# EAGLE design controller (EAGLE 9.6.2)
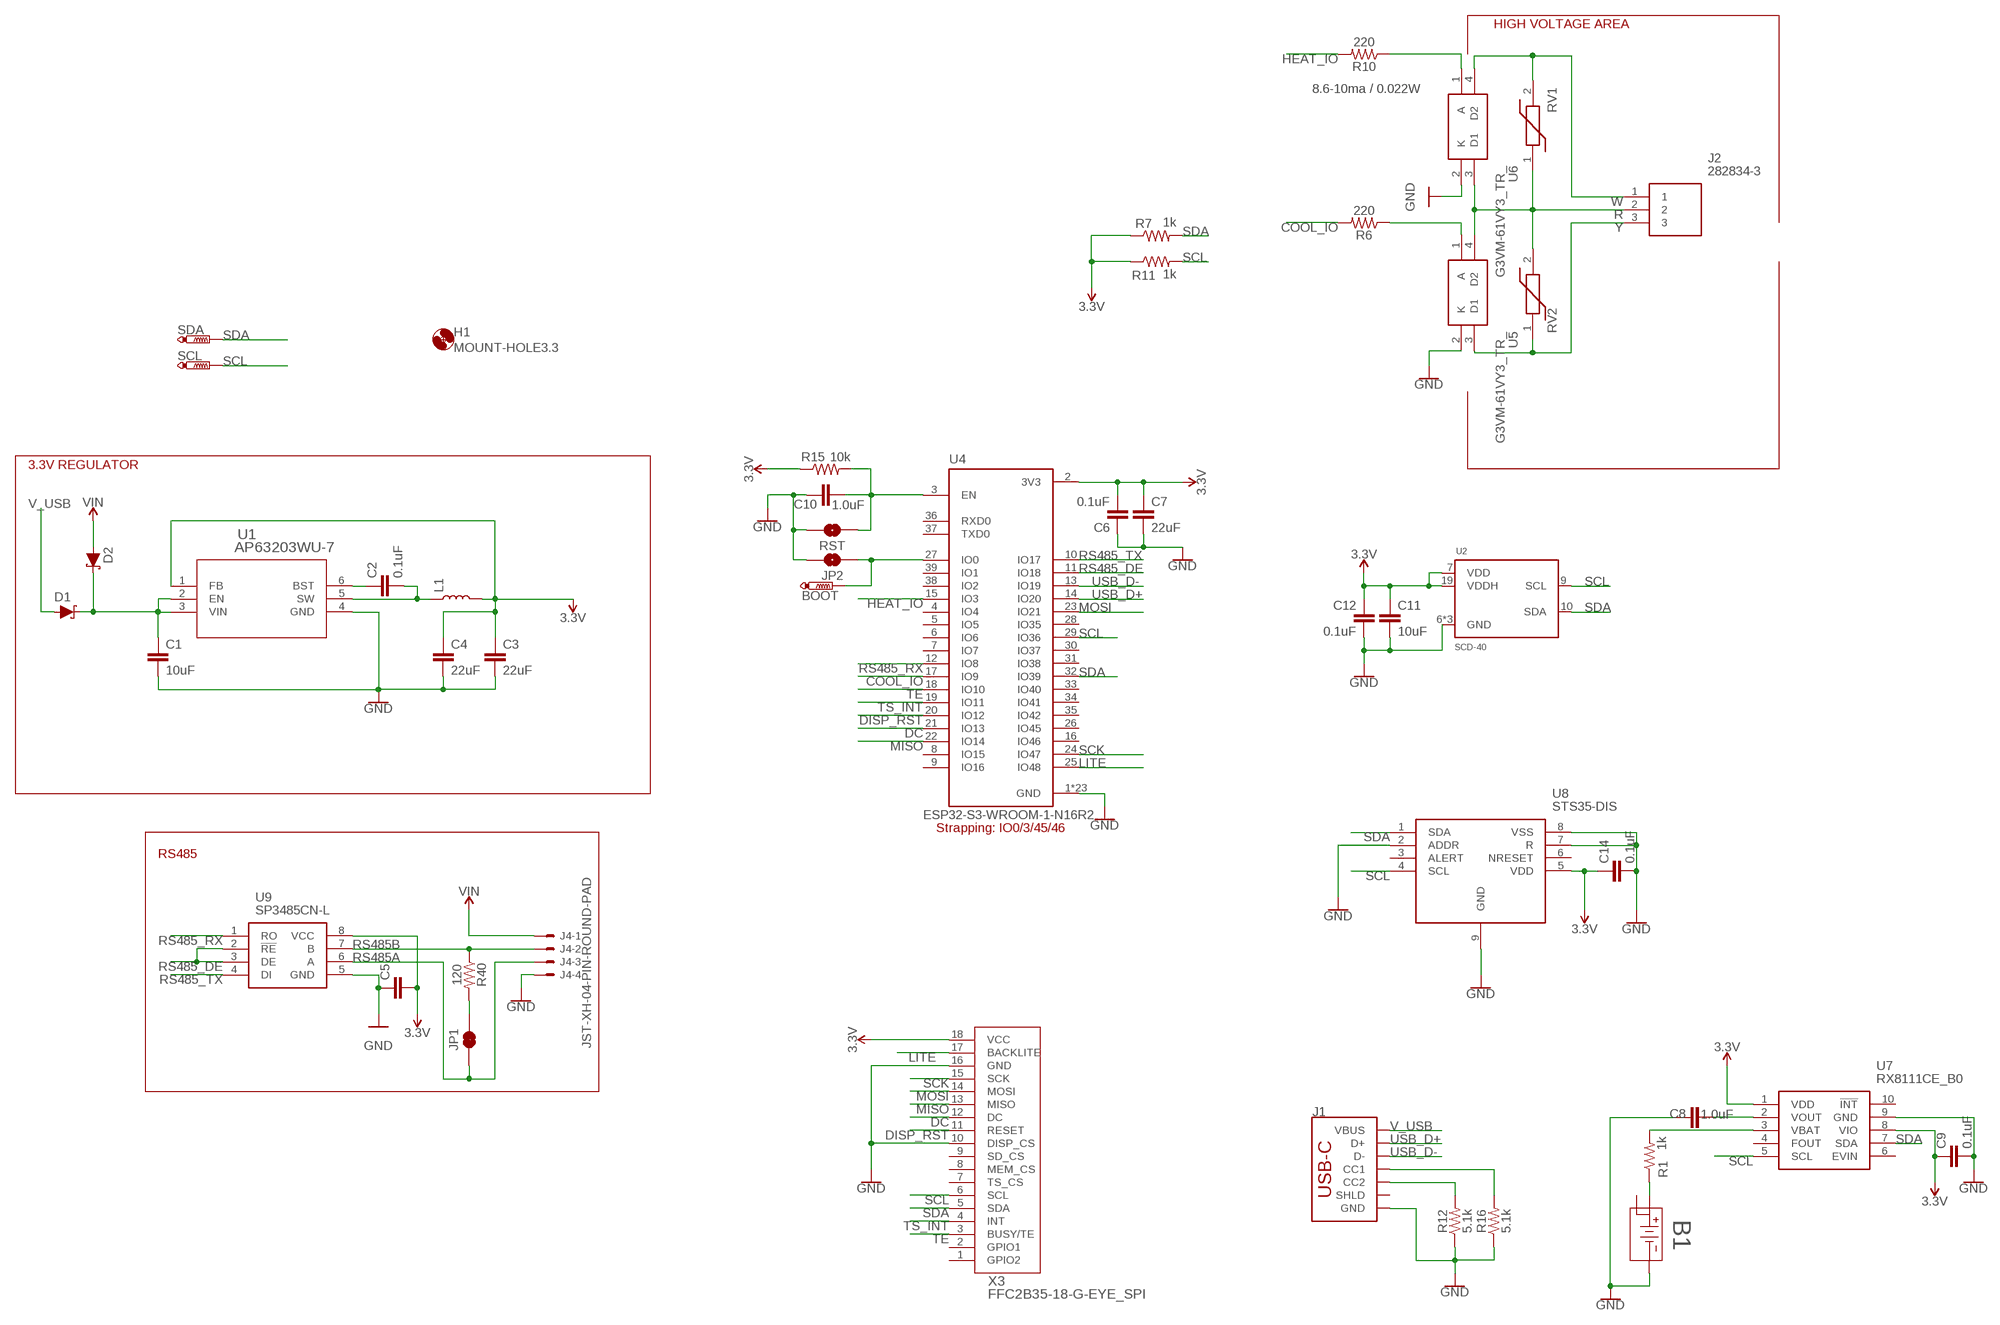
[diagram p0: schematic, sheet 1]

## Parts
B1  BAT-HLD-012-SMT  [BAT-HLD-012-SMT_TEC]
BOOT  PTR1B1,27  [B1,27]
C1  10uF  10UF-1206-6.3V-20%  [1206]
C2  0.1uF  0.1UF-0603-25V-5%  [0603]
C3  22uF  22UF-0805-6.3V-20%  [0805]
C4  22uF  22UF-0805-6.3V-20%  [0805]
C5  0.1uF  0.1UF-0603-25V-5%  [0603]
C6  0.1uF  0.1UF-0603-25V-5%  [0603]
C7  22uF  22UF-0805-6.3V-20%  [0805]
C8  1.0uF  1.0UF-0603-16V-10%  [0603]
C9  0.1uF  0.1UF-0603-25V-5%  [0603]
C10  1.0uF  1.0UF-0603-16V-10%  [0603]
C11  10uF  10UF-1206-6.3V-20%  [1206]
C12  0.1uF  0.1UF-0603-25V-5%  [0603]
C14  0.1uF  0.1UF-0603-25V-5%  [0603]
D1  1A/23V/620mV  DIODE-SCHOTTKY-BAT20J  [SOD-323]
D2  1A/23V/620mV  DIODE-SCHOTTKY-BAT20J  [SOD-323]
H1  MOUNT-HOLE3.3  [3,3]
J1  USB_C_2-LAYER_PADS  [USB-C-16P-2LAYER-PADS]
J2  282834-3  [2828343]
J4  JST-XH-04-PIN-ROUND-PAD  [JST-XH-04-PACKAGE-ROUND-PAD]
JP1  JUMPER-SMT_2_NC_TRACE_NO-SILK  [SMT-JUMPER_2_NC_TRACE_NO-SILK]
JP2  JUMPER-SMT_2_NO_NO-SILK  [SMT-JUMPER_2_NO_NO-SILK]
L1  4.7μH_SHIELDED_INDUCTOR  [1008(2520)]
R1  1k  1KOHM-0603-1/10W-1%  [0603]
R6  220  220OHM-0603-1/10W-1%  [0603]
R7  1k  1KOHM-0603-1/10W-1%  [0603]
R10  220  220OHM-0603-1/10W-1%  [0603]
R11  1k  1KOHM-0603-1/10W-1%  [0603]
R12  5.1k  5.1KOHM5.1KOHM-0603-1/10W-1%  [0603]
R15  10k  10KOHM-0603-1/10W-1%  [0603]
R16  5.1k  5.1KOHM5.1KOHM-0603-1/10W-1%  [0603]
R40  120  120OHM-0603-1/10W-5%  [0603]
RST  JUMPER-SMT_2_NO_NO-SILK  [SMT-JUMPER_2_NO_NO-SILK]
RV1  ZV35K1210251NIR1  [VARC3225X145N]
RV2  ZV35K1210251NIR1  [VARC3225X145N]
SCL  PTR1B1,27  [B1,27]
SDA  PTR1B1,27  [B1,27]
U1  AP63203WU-7  [SOIC_05WU-7_DIO]
U2  SCD-40  [SCD40]
U4  ESP32-S3-WROOM-1-N16R2  [XCVR_ESP32-S3-WROOM-1-N16R2]
U5  G3VM-61VY3_TR_  [G3VM61VY3TR]
U6  G3VM-61VY3_TR_  [G3VM61VY3TR]
U7  RX8111CE_B0  [RX8111CEB0]
U8  STS35-DIS  [SON50P250X250X100-9N]
U9  SP3485CN-L  [SOIC127P600X175-8N]
X3  FFC2B35-18-G-EYE_SPI  [FFC2B3518G]

## Nets
3.3V: C3.1 C4.1 C5.2 C6.2 C7.1 C9.1 C11.1 C12.2 C14.1 L1.2 R7.1 R11.1 R15.1 U1.1(FB) U2.7(VDD) U2.19(VDDH) U4.2(3V3) U7.1(VDD) U7.8(VIO) U8.5(VDD) U9.8(VCC) X3.18(VCC)
COOL_IO: R6.2 U4.17(IO9)
DC: U4.21(IO13) X3.12(DC)
DISP_RST: U4.20(IO12) X3.11(RESET)
GND: B1.3 C1.2 C3.2 C4.2 C5.1 C6.1 C7.2 C8.1 C9.2 C10.1 C11.2 C12.1 C14.2 J1.GND J1.GND2(GND) J4.4 JP2.2 R12.1 R16.1 RST.2 U1.4(GND) U2.6(GND) U2.20(GND) U2.P$1(GND) U4.1(GND) U4.40(GND) U4.41_1(GND) U4.41_2(GND) U4.41_3(GND) U4.41_4(GND) U4.41_5(GND) U4.41_6(GND) U4.41_7(GND) U4.41_8(GND) U4.41_9(GND) U4.41_10(GND) U4.41_11(GND) U4.41_12(GND) U4.41_13(GND) U4.41_14(GND) U4.41_15(GND) U4.41_16(GND) U4.41_17(GND) U4.41_18(GND) U4.41_19(GND) U4.41_20(GND) U4.41_21(GND) U5.2(K) U6.2(K) U7.9(GND) U8.2(ADDR) U8.7(R) U8.8(VSS) U8.9(GND) U9.5(GND) X3.10(DISP_CS) X3.16(GND)
HEAT_IO: R10.2 U4.15(IO3)
LITE: U4.25(IO48) X3.17(BACKLITE)
MISO: U4.22(IO14) X3.13(MISO)
MOSI: U4.23(IO21) X3.14(MOSI)
N$1: C2.2 L1.1 U1.5(SW)
N$2: C2.1 U1.6(BST)
N$3: BOOT.TP JP2.1 U4.27(IO0)
N$4: R6.1 U5.1(A)
N$5: JP1.2 R40.2
N$6: B1.1 R1.1
N$7: J1.A5(CC1) R16.2
N$9: C10.2 R15.2 RST.1 U4.3(EN)
N$10: R10.1 U6.1(A)
N$14: J1.B5(CC2) R12.2
R: J2.2 RV1.1 RV2.2 U5.4(D2) U6.3(D1)
REG_IN: C1.1 D1.C D2.C U1.2(EN) U1.3(VIN)
RS485_DE: U4.11(IO18) U9.2(!RE) U9.3(DE)
RS485_RX: U4.12(IO8) U9.1(RO)
RS485_TX: U4.10(IO17) U9.4(DI)
RS485A: J4.3 JP1.1 U9.6(A)
RS485B: J4.2 R40.1 U9.7(B)
RTC_VBAT: R1.2 U7.3(VBAT)
RTC_VOUT: C8.2 U7.2(VOUT)
SCK: U4.24(IO47) X3.15(SCK)
SCL: R11.2 SCL.TP U2.9(SCL) U4.29(IO36) U7.5(SCL) U8.4(SCL) X3.6(SCL)
SDA: R7.2 SDA.TP U2.10(SDA) U4.32(IO39) U7.7(SDA) U8.1(SDA) X3.5(SDA)
TE: U4.18(IO10) X3.3(BUSY/TE)
TS_INT: U4.19(IO11) X3.4(INT)
USB_D+: J1.A6(D+) J1.B6(D+) U4.14(IO20)
USB_D-: J1.A7(D-) J1.B7(D-) U4.13(IO19)
V_USB: D1.A J1.VBUS1(VBUS) J1.VBUS2(VBUS)
VIN: D2.A J4.1
W: J2.1 RV1.2 U6.4(D2)
Y: J2.3 RV2.1 U5.3(D1)
Unconnected: B1.2 J1.SHLD1(SHLD) J1.SHLD2(SHLD) J1.SHLD3(SHLD) J1.SHLD4(SHLD) U4.4(IO4) U4.5(IO5) U4.6(IO6) U4.7(IO7) U4.8(IO15) U4.9(IO16) U4.16(IO46) U4.26(IO45) U4.28(IO35) U4.30(IO37) U4.31(IO38) U4.33(IO40) U4.34(IO41) U4.35(IO42) U4.36(RXD0) U4.37(TXD0) U4.38(IO2) U4.39(IO1) U7.4(FOUT) U7.6(EVIN) U7.10(!INT) U8.3(ALERT) U8.6(NRESET) X3.1(GPIO2) X3.2(GPIO1) X3.7(TS_CS) X3.8(MEM_CS) X3.9(SD_CS)

## Notes on the sheet
- HIGH VOLTAGE AREA
- 8.6-10ma / 0.022W
- 3.3V REGULATOR
- Strapping: IO0/3/45/46
- RS485

## Library data of the parts
B1 = Battery holders:BAT-HLD-012-SMT; COPYRIGHT: Copyright (C) 2024 Ultra Librarian. All rights reserved.; MANUFACTURER_PART_NUMBER: BAT-HLD-012-SMT; MFR_NAME: TE Connectivity
BOOT SCL SDA = testpad:PTR1: TEST PIN
C1 C11 = SparkFun-Capacitors:10UF: 10.0µF ceramic capacitors A capacitor is a passive two-terminal electrical component used to store electrical energy temporarily in an electric field.; PROD_ID: CAP-10057
C2 C5 C6 C9 C12 C14 = SparkFun-Capacitors:0.1UF: 0.1µF ceramic capacitors A capacitor is a passive two-terminal electrical component used to store electrical energy temporarily in an electric field.; PROD_ID: CAP-08604
C3 C4 C7 = SparkFun-Capacitors:22UF: 22µF ceramic capacitors A capacitor is a passive two-terminal electrical component used to store electrical energy temporarily in an electric field.; PROD_ID: CAP-08402
C8 C10 = SparkFun-Capacitors:1.0UF: 1µF ceramic capacitors A capacitor is a passive two-terminal electrical component used to store electrical energy temporarily in an electric field.; PROD_ID: CAP-00868
D1 D2 = SparkFun-DiscreteSemi:DIODE-SCHOTTKY: Schottky diode A Schottky diode is a semiconductor diode which has a low forward voltage drop and a very fast switching action.; PROD_ID: DIO-11623
H1 = holes:MOUNT-HOLE: MOUNTING HOLE with drill center marker
J1 = SparkFun-Connectors:USB_C: USB Type C 16Pin Connector Super Speed pins not available on the 16-pin purely SMD connector so this part is best for USB 2.0 implementations. D1 and D2 are tied together enabling D+/- no matter which way the cable is plugged into the connector. The two channel configuration pins (CC1/2) are exposed. These are normally connected to ground via 5.1k resistors but can be reconfigured for high current/high power applications. **4-LAYER BOARD WARNING!!** If designing 4-layer board, make sure to select the variant _4-LAYER-ISOLATED. The linked footprint (USB-C-16-4LAYER-ISOLATED) includes some very necessary cutout polygons in the inner layers (2 and 15). This prevents the PTH mounting shield legs on the USB connector from electrically connecting any other polygons on the inner layers (usually VCC and GND).; PROD_ID: CONN-14122
J2 = TE terminal block 282834-3:282834-3: Connector pcb 3 way 2.54mm Termi-Block Source: Datasheet <https://www.te.com/commerce/DocumentDelivery/DDEController?Action=showdoc&DocId=Customer Drawing282834C1pdfEnglishENG_CD_282834_C1.pdf282834-3>; DESCRIPTION: Connector pcb 3 way 2.54mm Termi-Block; HEIGHT: 10mm; MANUFACTURER_NAME: TE Connectivity; MANUFACTURER_PART_NUMBER: 282834-3; MOUSER_PART_NUMBER: 571-2828343; MOUSER_PRICE-STOCK: https://www.mouser.co.uk/ProductDetail/TE-Connectivity/282834-3?qs=A%252Bip%252BNCYi6M69kAjqV38yA%3D%3D
J4 = Rembrandt Electronics - JST XH Connectors v1-0:JST-XH-04-PIN: JST XH Connector 2 Pin Wire to board connector. Pitch: 2,54 mm, (0.100") Number of pins: 4 Created by Rembrandt Electronics www.rembrandtelectronics.com
JP1 = SparkFun-Jumpers:JUMPER-SMT_2_NC_TRACE: Normally closed trace jumper This jumper has a trace between two pads so it's normally closed (NC). Use a razor knife to open the connection. For best results follow the IPC guidelines for cutting traces: Cutout at least 0.063 mm (0.005 in). Remove all loose material to clean up the cut area. Seal the cut with an approved epoxy. Reapply solder to reclose the connection.
JP2 RST = SparkFun-Jumpers:JUMPER-SMT_2_NO: Normally open jumper This jumper has two pads in close proximity to each other. Apply solder to close the connection. Round pads are easier to solder for beginners, but are a lot larger. SparkFun Product that uses the round pads: SparkFun EL Sequencer <https://www.sparkfun.com/products/12781>
L1 = SparkFun-Coils:4.7μH_SHIELDED_INDUCTOR: 4.7uH Inductor 4.7uH 1.4A 50mOhm 1008(2520) Package Shielded; PROD_ID: NDUC-14880
R1 R7 R11 = SparkFun-Resistors:1KOHM: 1kΩ resistor A resistor is a passive two-terminal electrical component that implements electrical resistance as a circuit element. Resistors act to reduce current flow, and, at the same time, act to lower voltage levels within circuits. - Wikipedia; PROD_ID: RES-07856
R6 R10 = SparkFun-Resistors:220OHM: 220Ω resistor A resistor is a passive two-terminal electrical component that implements electrical resistance as a circuit element. Resistors act to reduce current flow, and, at the same time, act to lower voltage levels within circuits. - Wikipedia; PROD_ID: RES-07861
R12 R16 = SparkFun-Resistors:5.1KOHM; PROD_ID: RES-12083
R15 = SparkFun-Resistors:10KOHM: 10kΩ resistor A resistor is a passive two-terminal electrical component that implements electrical resistance as a circuit element. Resistors act to reduce current flow, and, at the same time, act to lower voltage levels within circuits. - Wikipedia; PROD_ID: RES-00824
R40 = Resistors:120OHM
RV1 RV2 = Bourns Varistor ZV35K1210251NIR1:ZV35K1210251NIR1: Varistors ZV 35V 10% Source: Datasheet <https://g.componentsearchengine.com/Datasheets/2/ZV60K1210251NIR1HT.pdf>; DESCRIPTION: Varistors ZV 35V 10%; HEIGHT: 1.45mm; MANUFACTURER_NAME: Bourns; MANUFACTURER_PART_NUMBER: ZV35K1210251NIR1; MOUSER_PART_NUMBER: 652-ZV35K1210251NIR1; MOUSER_PRICE-STOCK: https://www.mouser.co.uk/ProductDetail/Bourns/ZV35K1210251NIR1?qs=GBLSl2AkirutxOaOmtSxyA%3D%3D
U1 = Diodes buck converter:AP63203WU-7; COPYRIGHT: Copyright (C) 2023 Ultra Librarian. All rights reserved.; MANUFACTURER_PART_NUMBER: AP63203WU-7; MFR_NAME: Diodes Inc
U2 = Adafruit SCD-41:SCD-40
U4 = ESP32-S3-WROOM-1-N16R2:ESP32-S3-WROOM-1-N16R2: Check availability <https://pricing.snapeda.com/parts/ESP32S3WROOM1N16R2/Espressif%20Systems/view-part?ref=eda>; AVAILABILITY: In Stock; CHECK_PRICES: https://www.snapeda.com/parts/ESP32S3WROOM1N16R2/Espressif+Systems/view-part/?ref=eda; DESCRIPTION: Bluetooth, WiFi 802.11b/g/n, Bluetooth v5.0 Transceiver Module 2.4GHz PCB Trace Surface Mount; MF: Espressif Systems; MP: ESP32S3WROOM1N16R2; PACKAGE: NON STANDARD Espressif Systems; PRICE: None; PURCHASE-URL: https://www.snapeda.com/api/url_track_click_mouser/?unipart_id=10874217&manufacturer=Espressif Systems&part_name=ESP32S3WROOM1N16R2&search_term=None; SNAPEDA_LINK: https://www.snapeda.com/parts/ESP32S3WROOM1N16R2/Espressif+Systems/view-part/?ref=snap
U5 U6 = Omron SSR G3VM-61VY3_TR_:G3VM-61VY3_TR_: Solid State Relays - PCB Mount MOSFET Relay SOP4 60V 700mA 1 Form A Source: Datasheet <https://www.arrow.com/en/products/g3vm-61vy3-tr/omron>; DESCRIPTION: Solid State Relays - PCB Mount MOSFET Relay SOP4 60V 700mA 1 Form A; HEIGHT: 2.5mm; MANUFACTURER_NAME: Omron Electronics; MANUFACTURER_PART_NUMBER: G3VM-61VY3(TR); MOUSER_PART_NUMBER: 653-G3VM-61VY3TR; MOUSER_PRICE-STOCK: https://www.mouser.co.uk/ProductDetail/Omron-Electronics/G3VM-61VY3TR?qs=F5EMLAvA7IDWDr%252BrEjvwmw%3D%3D
U7 = RX8111CE_B0:RX8111CE_B0: Real Time Clock RX8111CE:B0 REAL TIME CLOCK I2C-BUS 3.0V 23PPM 1K TR Source: Datasheet <https://support.epson.biz/td/api/doc_check.php?dl=app_RX8111CE&lang=en>; DESCRIPTION: Real Time Clock RX8111CE:B0 REAL TIME CLOCK I2C-BUS 3.0V 23PPM 1K TR; HEIGHT: 1mm; MANUFACTURER_NAME: Epson Timing; MANUFACTURER_PART_NUMBER: RX8111CE B0; MOUSER_PART_NUMBER: 732-RX8111CEB0; MOUSER_PRICE-STOCK: https://www.mouser.co.uk/ProductDetail/Epson-Timing/RX8111CE-B0?qs=4qgZ1GHix0XWELEbfCuzyg%3D%3D
U8 = STS35-DIS:STS35-DIS: Board Mount Temperature Sensors High-accuracy Digital Temperature Sensor IC Source: Datasheet <https://componentsearchengine.com/Datasheets/1/STS35-DIS.pdf>; DESCRIPTION: Board Mount Temperature Sensors High-accuracy Digital Temperature Sensor IC; HEIGHT: 1mm; MANUFACTURER_NAME: Sensirion; MANUFACTURER_PART_NUMBER: STS35-DIS; MOUSER_PART_NUMBER: 403-STS35-DIS; MOUSER_PRICE-STOCK: https://www.mouser.co.uk/ProductDetail/Sensirion/STS35-DIS?qs=F5EMLAvA7IBgq10iVaCNnw%3D%3D
U9 = MaxLinear RS485 SP3485CN-L:SP3485CN-L: Transceiver RS-485 3.3V 10Mbps SOIC8 EXAR SP3485CN-L, Line Transceiver, RS-422, RS-485, 3.3 V, 8-Pin SOIC Source: Datasheet <https://componentsearchengine.com/Datasheets/1/SP3485CN-L.pdf>; DESCRIPTION: Transceiver RS-485 3.3V 10Mbps SOIC8 EXAR SP3485CN-L, Line Transceiver, RS-422, RS-485, 3.3 V, 8-Pin SOIC; HEIGHT: 1.75mm; MANUFACTURER_NAME: EXAR; MANUFACTURER_PART_NUMBER: SP3485CN-L; MOUSER_PART_NUMBER: 701-SP3485CN-L; MOUSER_PRICE-STOCK: https://www.mouser.com/Search/Refine.aspx?Keyword=701-SP3485CN-L
X3 = GCT FFC2B35-18-G:FFC2B35-18-G-EYE_SPI: FFC & FPC Connectors .5mm SideEntry Flat Flex Cbl Conn 18P Au Source: Datasheet; DESCRIPTION: FFC & FPC Connectors .5mm SideEntry Flat Flex Cbl Conn 18P Au; HEIGHT: 2.2mm; MANUFACTURER_NAME: GCT (GLOBAL CONNECTOR TECHNOLOGY); MANUFACTURER_PART_NUMBER: FFC2B35-18-G; MOUSER_PART_NUMBER: 640-FFC2B35-18-G; MOUSER_PRICE-STOCK: https://www.mouser.co.uk/ProductDetail/GCT/FFC2B35-18-G?qs=Li%252BoUPsLEntRHHb6c10PFg%3D%3D

## Board
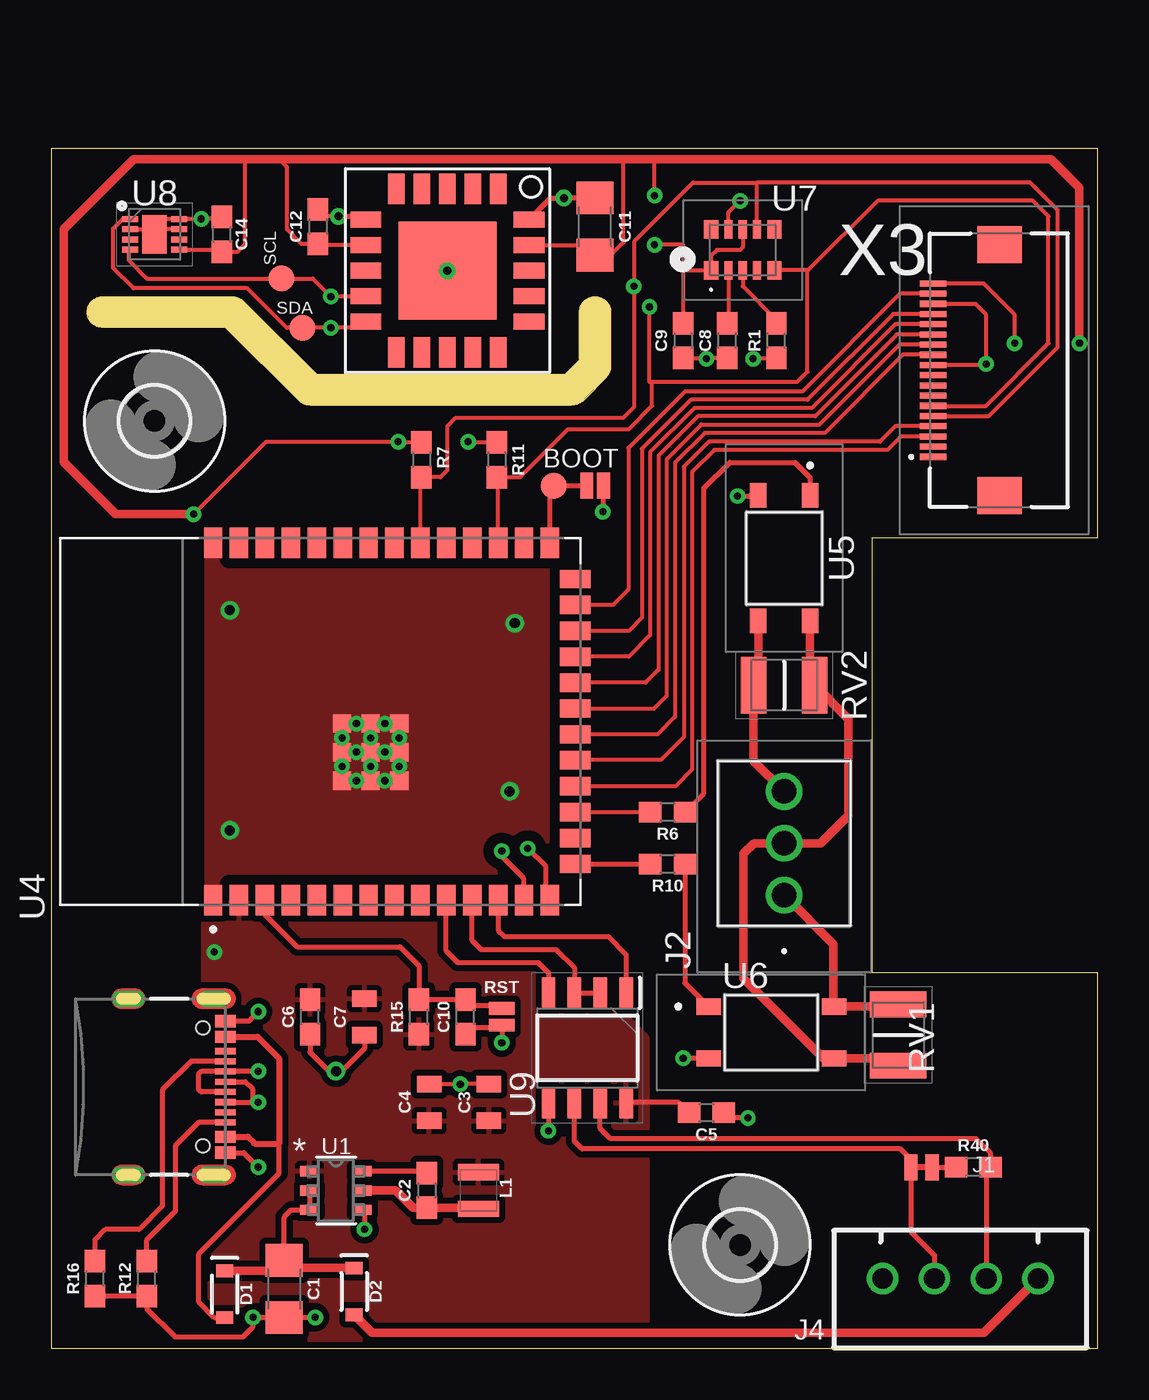
[diagram p1: board, top side]
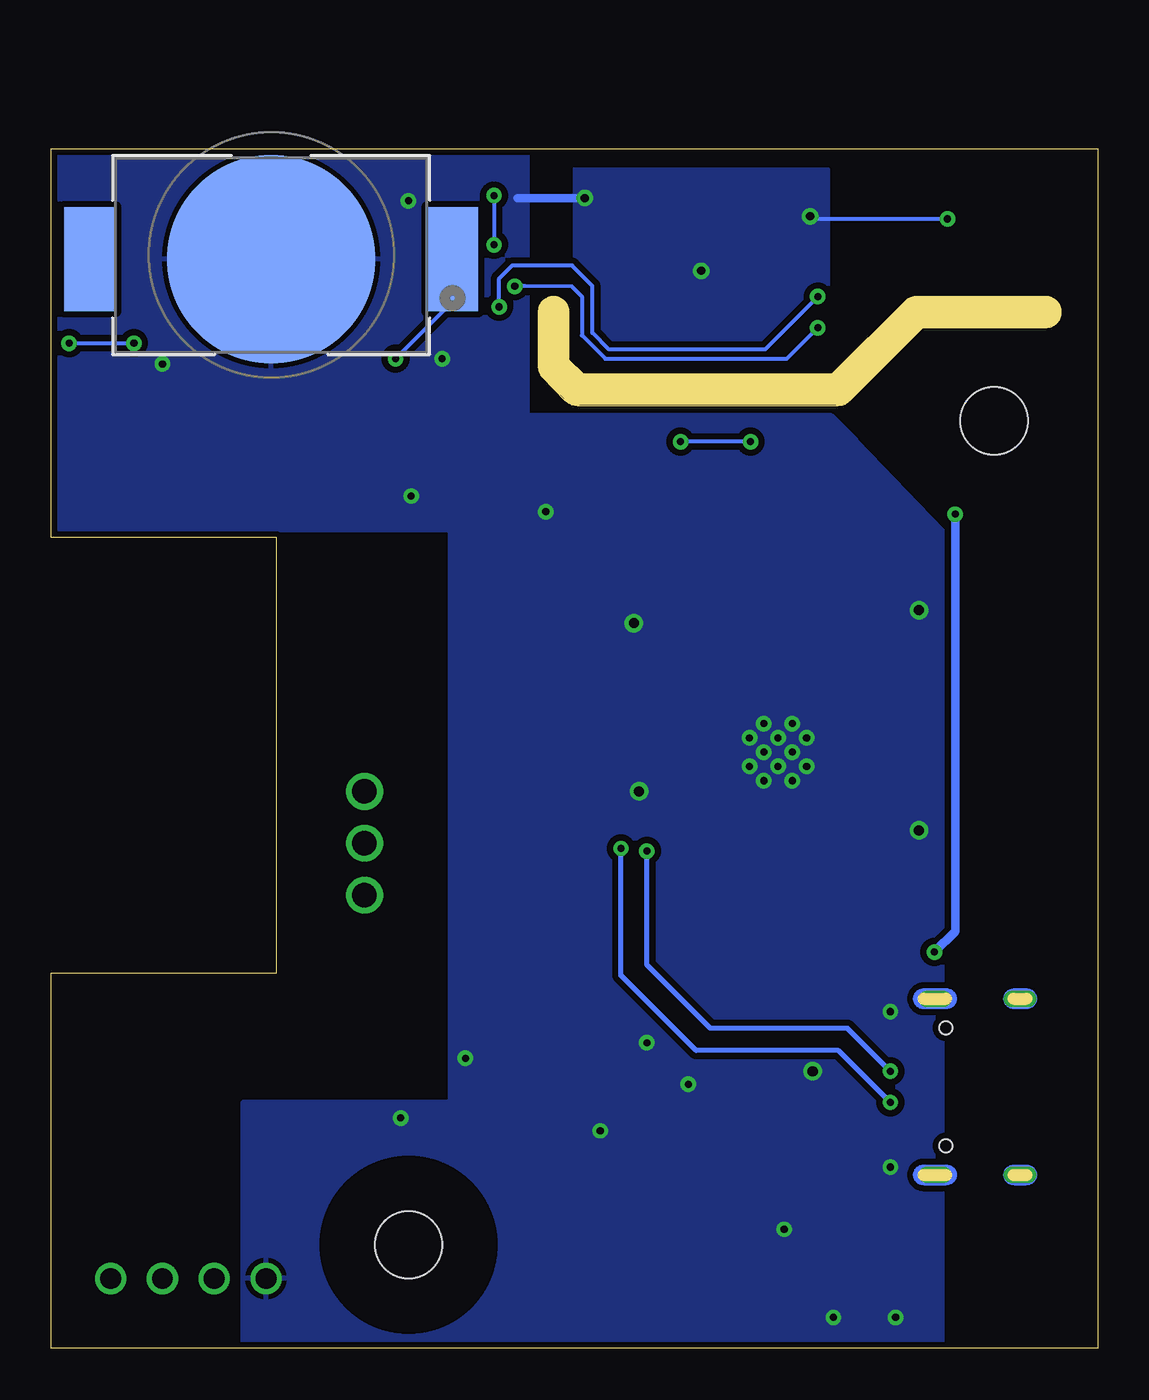
[diagram p2: board, bottom side, seen from below]

Size 51.31 x 58.8 mm. Coordinates in mm from the lower left corner, seen from the top.
Outline: 0,0 51.31,0 51.31,18.41 40.26,18.41 40.26,39.75 51.31,39.75 51.31,58.8 0,58.8 0,0
Outline: 2.54,51.56 8.89,51.56 arc-45 9.43,51.34 13.02,47.75 25.21,47.75 25.91,48.45 25.91,50.8 arc-180 27.43,50.8 27.43,48.13 arc-45 27.22,47.62 26.1,46.48 arc-45 25.51,46.23 12.7,46.23 arc-45 12.16,46.45 8.57,50.04 2.54,50.04 arc-180 2.54,51.56
Copper layers (1*16): Top 0.035mm / dielectric 1.6mm / Bottom 0.035mm
Design rules "custom_jlcpcb_2layer *": minimum track width 5mil, minimum drill 12mil, track to track 5mil, track to pad 5mil, pad to pad 5mil, via to via 20mil, smd to smd 0mil, copper to edge 0.3mm, drill to drill 0.5mm, minimum pad ring 8mil, minimum via ring 8mil, stop-mask expansion 0mil, vias tented up to drill 100mil, thermal gap 10mil
Milling: 5 lines

### Footprints (pad centres in the part's own frame; a part is rotated, then mirrored left to right if it is on the bottom)
BAT-HLD-012-SMT_TEC = smd 2.489 x 5.105: 1 -8.9,0.2; 2 8.9,0.2 | smd 10.211 x 10.211: 3 0,0.2
B1,27 = smd 1.27 x 1.27: TP 0,0
1206 = smd 1.6 x 1.8: 1 -1.4,0; 2 1.4,0
0603 = smd 1.1 x 1: 1 -0.85,0; 2 0.85,0
0805 = smd 0.8 x 1.2: 1 -0.9,0; 2 0.9,0
SOD-323 = smd 0.63 x 0.83: A 1.15,0; C -1.15,0
3,3 = hole 3.3: 0,0
USB-C-16P-2LAYER-PADS = smd 0.3 x 1: A5 -1.25,-0.34; A6 -0.25,-0.34; A7 0.25,-0.34; A8 1.25,-0.34; B5 1.75,-0.34; B6 0.75,-0.34; B7 -0.75,-0.34; B8 -1.75,-0.34 | smd 0.6 x 1: GND -3.225,-0.34; GND2 3.225,-0.34; VBUS1 -2.45,-0.34; VBUS2 2.45,-0.34 | drill 0.4 pad 0.6 long: SHLD1 -4.318,-0.915; SHLD2 4.318,-0.915; SHLD3 -4.318,-5.095; SHLD4 4.318,-5.095 | hole 0.65: -2.89,-1.445; 2.89,-1.445
2828343 = drill 1.2 pad 1.8: 1 0,0; 2 2.54,0; 3 5.08,0
JST-XH-04-PACKAGE-ROUND-PAD = drill 1.016: 1 -3.81,0; 2 -1.27,0; 3 1.27,0; 4 3.81,0
SMT-JUMPER_2_NC_TRACE_NO-SILK = smd 0.66 x 1.27: 1 -0.521,0; 2 0.521,0
SMT-JUMPER_2_NO_NO-SILK = smd 0.635 x 1.27: 1 -0.406,0; 2 0.406,0
1008(2520) = smd 0.8 x 2: 1 -0.9,0; 2 0.9,0
VARC3225X145N = smd 1.25 x 2.75: 1 -1.5,0; 2 1.5,0
SOIC_05WU-7_DIO = smd 0.902 x 0.508: 1 -1.302,0.95; 2 -1.302,0; 3 -1.302,-0.95; 4 1.302,-0.95; 5 1.302,0; 6 1.302,0.95
SCD40 = smd 1.5 x 0.8: 1 -4,2.5; 2 -4,1.25; 3 -4,0; 4 -4,-1.25; 5 -4,-2.5; 11 4,-2.5; 12 4,-1.25; 13 4,0; 14 4,1.25; 15 4,2.5 | smd 0.8 x 1.5: 6 -2.5,-4; 7 -1.25,-4; 8 0,-4; 9 1.25,-4; 10 2.5,-4; 16 2.5,4; 17 1.25,4; 18 0,4; 19 -1.25,4; 20 -2.5,4 | smd 4.8 x 4.8: P$1 0,0
XCVR_ESP32-S3-WROOM-1-N16R2 = smd 1.5 x 0.9: 1 -8.75,5.26; 2 -8.75,3.99; 3 -8.75,2.72; 4 -8.75,1.45; 5 -8.75,0.18; 6 -8.75,-1.09; 7 -8.75,-2.36; 8 -8.75,-3.63; 9 -8.75,-4.9; 10 -8.75,-6.17; 11 -8.75,-7.44; 12 -8.75,-8.71; 13 -8.75,-9.98; 14 -8.75,-11.25; 27 8.75,-11.25; 28 8.75,-9.98; 29 8.75,-8.71; 30 8.75,-7.44; 31 8.75,-6.17; 32 8.75,-4.9; 33 8.75,-3.63; 34 8.75,-2.36; 35 8.75,-1.09; 36 8.75,0.18; 37 8.75,1.45; 38 8.75,2.72; 39 8.75,3.99; 40 8.75,5.26 | smd 0.9 x 1.5: 15 -6.985,-12.5; 16 -5.715,-12.5; 17 -4.445,-12.5; 18 -3.175,-12.5; 19 -1.905,-12.5; 20 -0.635,-12.5; 21 0.635,-12.5; 22 1.905,-12.5; 23 3.175,-12.5; 24 4.445,-12.5; 25 5.715,-12.5; 26 6.985,-12.5 | smd 0.9 x 0.9: 41_1 -1.5,-2.46; 41_2 -2.9,-2.46; 41_3 -0.1,-2.46; 41_4 -2.9,-3.86; 41_5 -1.5,-3.86; 41_6 -0.1,-3.86; 41_7 -2.9,-1.06; 41_8 -1.5,-1.06; 41_9 -0.1,-1.06 | drill 0.35 pad 0.61: 41_10 -1.5,-1.76; 41_11 -2.9,-1.76; 41_12 -0.1,-1.76; 41_13 -2.9,-3.16; 41_14 -1.5,-3.16; 41_15 -0.1,-3.16; 41_16 -2.2,-1.06; 41_17 -0.8,-1.06; 41_18 -2.2,-2.46; 41_19 -0.8,-2.46; 41_20 -2.2,-3.86; 41_21 -0.8,-3.86
G3VM61VY3TR = smd 0.8 x 1.2: 1 -1.27,-3.075; 2 1.27,-3.075; 3 1.27,3.075; 4 -1.27,3.075
RX8111CEB0 = smd 0.7 x 0.9: 1 -1.55,-1; 5 1.55,-1; 6 1.55,1; 10 -1.55,1 | smd 0.4 x 0.9: 2 -0.7,-1; 3 0,-1; 4 0.7,-1; 7 0.7,1; 8 0,1; 9 -0.7,1
SON50P250X250X100-9N = smd 0.8 x 0.3: 1 -1.2,0.75; 2 -1.2,0.25; 3 -1.2,-0.25; 4 -1.2,-0.75; 5 1.2,-0.75; 6 1.2,-0.25; 7 1.2,0.25; 8 1.2,0.75 | smd 1.2 x 1.9: 9 0,0
SOIC127P600X175-8N = smd 1.5 x 0.65: 1 -2.7,1.905; 2 -2.7,0.635; 3 -2.7,-0.635; 4 -2.7,-1.905; 5 2.7,-1.905; 6 2.7,-0.635; 7 2.7,0.635; 8 2.7,1.905
FFC2B3518G = smd 0.3 x 1.3: 1 -4.25,1.198; 2 -3.75,1.198; 3 -3.25,1.198; 4 -2.75,1.198; 5 -2.25,1.198; 6 -1.75,1.198; 7 -1.25,1.198; 8 -0.75,1.198; 9 -0.25,1.198; 10 0.25,1.198; 11 0.75,1.198; 12 1.25,1.198; 13 1.75,1.198; 14 2.25,1.198; 15 2.75,1.198; 16 3.25,1.198; 17 3.75,1.198; 18 4.25,1.198 | smd 1.8 x 2.2: MP1 -6.15,-2.052; MP2 6.15,-2.052

### Placement (x,y rotation side)
B1  40.51,53.59 180 bottom
BOOT  24.64,42.29 0 top
C1  11.43,2.92 270 top
C2  18.41,7.75 270 top
C3  21.46,12.06 90 top
C4  18.54,12.06 90 top
C5  32.13,11.56 180 top
C6  12.7,16.26 90 top
C7  15.37,16.26 270 top
C8  33.15,49.4 90 top
C9  30.99,49.4 270 top
C10  20.32,16.26 90 top
C11  26.67,54.99 90 top
C12  13.08,54.99 270 top
C14  8.38,54.61 90 top
D1  8.51,2.67 270 top
D2  14.86,2.79 270 top
H1  33.78,5.08 0 top
H2  MOUNT-HOLE3.3  [3,3]  5.08,45.47 0 top
J1  8.89,12.83 270 top
J2  35.94,22.23 90 top
J4  44.58,3.43 180 top
JP1  42.67,8.89 0 top
JP2  26.67,42.29 0 top
L1  20.95,7.75 90 top
R1  35.56,49.4 90 top
R6  30.23,26.29 180 top
R7  18.16,43.56 270 top
R10  30.23,23.75 180 top
R11  21.84,43.56 270 top
R12  4.7,3.43 90 top
R15  18.03,16.26 90 top
R16  2.16,3.43 90 top
R40  45.21,8.89 180 top
RST  22.1,16.26 270 top
RV1  41.53,15.37 90 top
RV2  35.94,32.51 0 top
SCL  11.3,52.45 0 top
SDA  12.32,50.04 0 top
U1  13.97,7.75 0 top
U2  19.43,52.83 270 top
U4  13.21,30.73 90 top
U5  35.94,38.73 180 top
U6  35.31,15.49 270 top
U7  33.91,53.85 0 top
U8  5.08,54.61 0 top
U9  26.29,14.73 270 top
X3  44.45,47.96 90 top

### Tracks (layer width: path | path; a pad name or v marks a point on that pad's centre or on a via)
3.3V  (via drill 0.35)
  Top 0.203: U2.7 13.14,54.08 C12.2 12.28,54.14 11.56,54.86 11.56,57.91 11.18,58.3 | R11.1 20.61,44.41 20.57,44.45 v20.45,44.45 | R7.1 17.06,44.41 v17.02,44.45 10.54,44.45 v6.99,40.89 | 28.07,58.3 28.07,54.23 27.43,53.59 C11.1 26.18,54.08 U2.19 | U8.5 8.28,53.86 C14.1 9.14,53.76 9.53,54.14 9.53,58.3 | U7.8 33.91,53.98 33.78,53.85 32.64,53.85 32.36,53.57 U7.1 32.34,52.83 30.99,52.83 | v47.24,49.28 47.24,50.67 45.72,52.2 43.26,52.2 X3.18 | v29.59,56.52 29.59,58.3 | v29.59,54.1 30.99,54.1 30.99,52.83 | 30.99,52.83 C9.1
  Top 0.254: U9.8 28.23,12.06 30.77,12.06 C5.2
  Top 0.406: v6.99,40.89 3.17,40.89 0.63,43.44 0.63,54.86 4.06,58.3 9.53,58.3 11.18,58.3 28.07,58.3 29.59,58.3 49.02,58.3 50.42,56.9 v50.42,49.28
  Bottom 0.203: v17.02,44.45 v20.45,44.45 | v50.42,49.28 v47.24,49.28 | v29.59,56.52 v29.59,54.1
  Bottom 0.406: v8,19.43 6.99,20.45 v6.99,40.89
  pour Top (isolate 0.305, rank 3): 7.49,21.84 22.61,21.84 29.21,15.24 29.21,0 7.62,0 7.49,0.13
  cutout Top: 15.49,56.9 23.5,56.9 23.5,48.77 15.49,48.77
COOL_IO
  Top 0.203: U4.17 R6.2
DC
  Top 0.203: U4.21 29.55,31.37 30.19,32 30.19,43.59 31.88,45.29 37.67,45.29 41.59,49.2 X3.12
DISP_RST
  Top 0.203: U4.20 29.72,30.1 30.59,30.97 30.59,43.43 32.05,44.88 37.93,44.88 41.76,48.7 X3.11
GND  (via drill 0.35, 0.4, 0.5)
  Top 0.203: X3.10 45.79,48.2 v45.85,48.26 45.85,50.67 45.31,51.2 X3.16 | C11.2 | C12.1 13.42,55.5 v14.1,55.5 | C9.2 32.09,48.55 | 32.09,48.55 v32.13,48.51 | C8.1 32.09,48.55 | U7.9 33.21,55.69 v33.78,56.26 | C14.2 8.29,55.37 v7.37,55.37 6.29,55.37 U8.8 5.58,55.36 5.08,54.86 | U8.2 4.83,54.86 | 4.83,54.86 U8.9 | U8.7 5.08,54.86 | 5.08,54.86 4.83,54.86 | C4.2 20.05,12.96 | 20.05,12.96 v20.07,12.95 | C3.2 20.05,12.96
  Top 0.254: v14.1,55.5 15.43,55.5 U2.6 | U2.20 24.49,56.39 v25.15,56.39 C11.2 | C7.2 15.37,14.72 14.23,13.59 v13.97,13.59 13.63,13.59 12.7,14.52 C6.1 | J1.GND 9.7,16.05 v10.16,16.51 | J1.GND2 9.45,9.6 v10.16,8.89 | R16.1 R12.1 4.7,1.95 6.08,0.57 9.41,0.57 9.91,1.07 v9.91,1.52 | U1.4 15.37,6.8 v15.37,5.84 | U9.5 v24.38,10.67 | v34.16,11.3 33.23,11.3 C5.1 | JP2.2 27.05,42.27 v27.05,41.02 | C10.1 20.64,15.72 21.97,15.72 RST.2 v22.1,14.99 | v9.91,1.52 | v12.95,1.52 C1.2 v9.91,1.52 | U6.2 v30.99,14.22 | v33.66,41.78 34.26,41.78 34.29,41.81 U5.2
  Bottom 0.203: v7.37,55.37 13.97,55.37 v14.1,55.5
  Bottom 0.406: v25.15,56.39 28.45,56.39
  other vias: 8.76,25.4 19.43,52.83 22.48,27.3 22.73,35.56 8.76,36.2
  pour Bottom (isolate 0.305, rank 2): 7.62,0.13 7.62,40.1 11.81,44.45 11.81,44.47 13.06,45.72 27.94,45.72 27.94,58.55 51.31,58.55 51.31,40.13 31.75,40.13 31.75,12.06 41.91,12.06 41.91,0.13
  pour Bottom (no thermals): 12.7,31.88 19.05,31.88 19.05,25.53 12.7,25.53
  pour Top (isolate 0.508, no thermals): 7.62,22.61 24.89,22.61 24.89,39.5 7.62,39.5
  pour Bottom (isolate 0.305): 13.21,57.78 25.65,57.78 25.65,47.88 15.62,47.88 13.21,50.29
HEAT_IO
  Top 0.254: U4.15 R10.2
LITE
  Top 0.203: X3.17 41.62,51.7 36.83,46.91 31.08,46.91 28.31,44.14 28.31,37.2 27.56,36.45 U4.25
MISO
  Top 0.203: U4.22 29.15,32.64 29.78,33.27 29.78,43.76 31.71,45.7 37.47,45.7 41.47,49.7 41.46,49.7 X3.13
MOSI
  Top 0.203: X3.14 41.4,50.2 37.3,46.1 31.54,46.1 29.37,43.93 29.37,34.96 28.32,33.91 U4.23
N$1
  Top 0.406: U1.5 16.89,7.75 17.74,6.9 C2.2 20.91,6.9 L1.1
N$2
  Top 0.254: U1.6 18.32,8.7 C2.1
N$3
  Top 0.254: U4.27 24.46,42.11 BOOT.TP JP2.1
N$4
  Top 0.254: R6.1 32,27.22 32,42.16 33.27,43.43 36.48,43.43 37.21,42.7 U5.1
N$5
  Top 0.254: JP1.2 R40.2
N$6  (via drill 0.35)
  Top 0.203: R1.1 35.52,48.51 v34.42,48.51
  Bottom 0.203: v34.42,48.51 31.61,51.32 B1.1
N$7
  Top 0.254: J1.A5 6.86,14.08 5.46,12.68 5.46,6.99 4.32,5.84 2.67,5.84 2.16,5.33 R16.2
N$9
  Top 0.254: U4.3 10.49,21.26 12.06,19.68 17.11,19.68 18.03,18.76 R15.2 C10.2 20.64,16.79 21.97,16.79 RST.1
N$10
  Top 0.254: R10.1 31.08,17.92 U6.1
N$14
  Top 0.254: J1.B5 7.23,11.08 6.1,9.95 6.1,6.72 4.7,5.32 R12.2
R
  Top 0.406: U5.4 37.21,32.74 RV2.2 39.09,30.86 39.09,26.14 37.72,24.77 J2.2 34.45,24.77 33.95,24.26 33.95,18.15 37.87,14.22 U6.3 41.17,14.22 RV1.1
REG_IN
  Top 0.254: U1.2 U1.3 11.78,6.8 11.43,6.45 C1.1 11.18,4.07 | 10.93,3.82 11.18,4.07 | 11.3,3.94 11.18,4.07
  Top 0.406: D1.C 10.93,3.82 | D2.C 11.3,3.94
RS485_DE
  Top 0.254: U4.11 20.65,19.99 21.08,19.56 24.77,19.56 25.65,18.67 U9.3 U9.2
RS485_RX
  Top 0.254: U4.12 21.92,20.5 22.23,20.19 27.3,20.19 28.19,19.3 U9.1
RS485_TX
  Top 0.254: U4.10 19.38,19.48 19.94,18.92 23.88,18.92 24.38,18.41 U9.4
RS485A
  Top 0.254: U9.6 25.65,10.16 26.04,9.78 41.64,9.78 42.15,9.27 JP1.1 42.15,5.73 43.31,4.57 J4.3
RS485B
  Top 0.254: U9.7 26.92,10.79 27.43,10.29 45.34,10.29 46.06,9.56 R40.1 45.85,8.68 J4.2
RTC_VBAT
  Top 0.203: U7.3 33.91,52.07 35.56,50.42 R1.2
RTC_VOUT
  Top 0.203: U7.2 33.21,50.02 C8.2
SCK
  Top 0.203: U4.24 28.32,35.18 28.97,35.83 28.97,44.1 31.38,46.51 37.08,46.51 41.28,50.7 X3.15
SCL  (via drill 0.35)
  Top 0.203: X3.6 45.82,46.2 48.9,49.28 48.9,55.5 48.13,56.26 40.52,56.26 37.11,52.85 37.08,52.85 | 37.08,52.85 U7.5 | U4.29 21.92,42.64 R11.2 22.99,42.71 25.34,45.06 28.32,45.06 29.46,46.21 29.46,47.37 | 37.08,52.85 37.08,47.88 36.58,47.37 29.46,47.37 | v29.34,51.05 29.34,47.37 29.46,47.37 | v13.72,51.56 v13.71,51.56 | U8.4 3.81,53.79 3.81,53.34 4.7,52.45 SCL.TP 12.83,52.45 v13.72,51.56 | v13.72,51.56 13.74,51.58 U2.9
  Bottom 0.203: v29.34,51.05 29.34,52.45 28.7,53.09 25.77,53.09 24.77,52.08 24.77,49.78 23.95,48.97 16.31,48.97 v13.72,51.56
SDA  (via drill 0.35)
  Top 0.203: X3.5 45.97,45.7 49.35,49.08 49.35,55.8 48.01,57.15 34.61,57.15 | U7.7 34.61,57.15 | U8.1 3.51,55.37 3.05,54.9 3.05,52.96 4.04,51.96 9.63,51.96 11.55,50.04 SDA.TP v13.72,50.04 15.14,50.04 U2.10 | 34.61,57.15 31.47,57.15 28.6,54.28 28.6,52.1 v28.57,52.07 28.57,46.14 28.06,45.62 19.84,45.62 19.43,45.21 19.43,43.05 19.09,42.71 R7.2 18.11,42.66 U4.32
  Bottom 0.203: v28.57,52.07 28.55,52.09 28.09,52.09 25.78,52.07 25.28,51.57 25.28,49.66 24.13,48.51 15.24,48.51 v13.72,50.04
TE
  Top 0.203: X3.3 41.66,44.7 41,44.04 32.51,44.04 31.43,42.96 31.43,28.38 30.61,27.56 U4.18
TS_INT
  Top 0.203: X3.4 41.4,45.2 40.64,44.45 32.26,44.45 31.02,43.22 31.02,29.97 29.93,28.87 25.75,28.87 U4.19
USB_D+  (via drill 0.35)
  Top 0.254: J1.A6 9.53,13.08 9.91,12.7 9.91,12.19 9.79,12.08 J1.B6 10.15,12.08 v10.16,12.06 | U4.14 24.26,22.18 24.26,23.62 v23.37,24.51
  Bottom 0.254: v10.16,12.06 12.7,14.61 19.68,14.61 23.37,18.29 v23.37,24.51
USB_D-  (via drill 0.35)
  Top 0.254: J1.A7 7.36,12.58 7.24,12.7 7.24,13.46 7.35,13.58 J1.B7 10.15,13.58 v10.16,13.59 | v22.1,24.38 22.1,24.13 23.19,23.04 U4.13
  Bottom 0.254: v10.16,13.59 12.27,15.7 18.99,15.7 22.1,18.81 v22.1,24.38
V_USB
  Top 0.254: 9.95,10.08 9.99,10.03 | D1.A 8,1.52 7.24,2.28 7.24,4.64 11.18,8.58 11.18,10.03
  Top 0.305: J1.VBUS2 9.65,10.38 9.95,10.08 | J1.VBUS1 10.12,15.28 11.18,14.22 11.18,10.03 9.99,10.03
VIN
  Top 0.406: J4.1 45.72,0.76 30.48,0.76 29.84,0.76 15.74,0.76 D2.A
W
  Top 0.406: RV1.2 41.43,16.76 U6.4 38.35,16.79 38.35,19.81 J2.1
Y
  Top 0.406: U5.3 34.67,32.74 RV2.1 34.44,28.8 J2.3